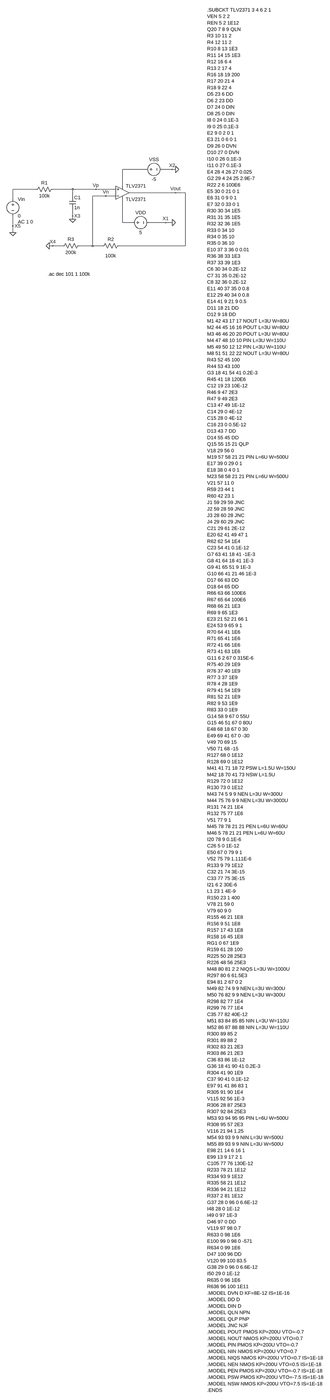
[diagram p0: schematic project5_p1.asc, whole sheet]
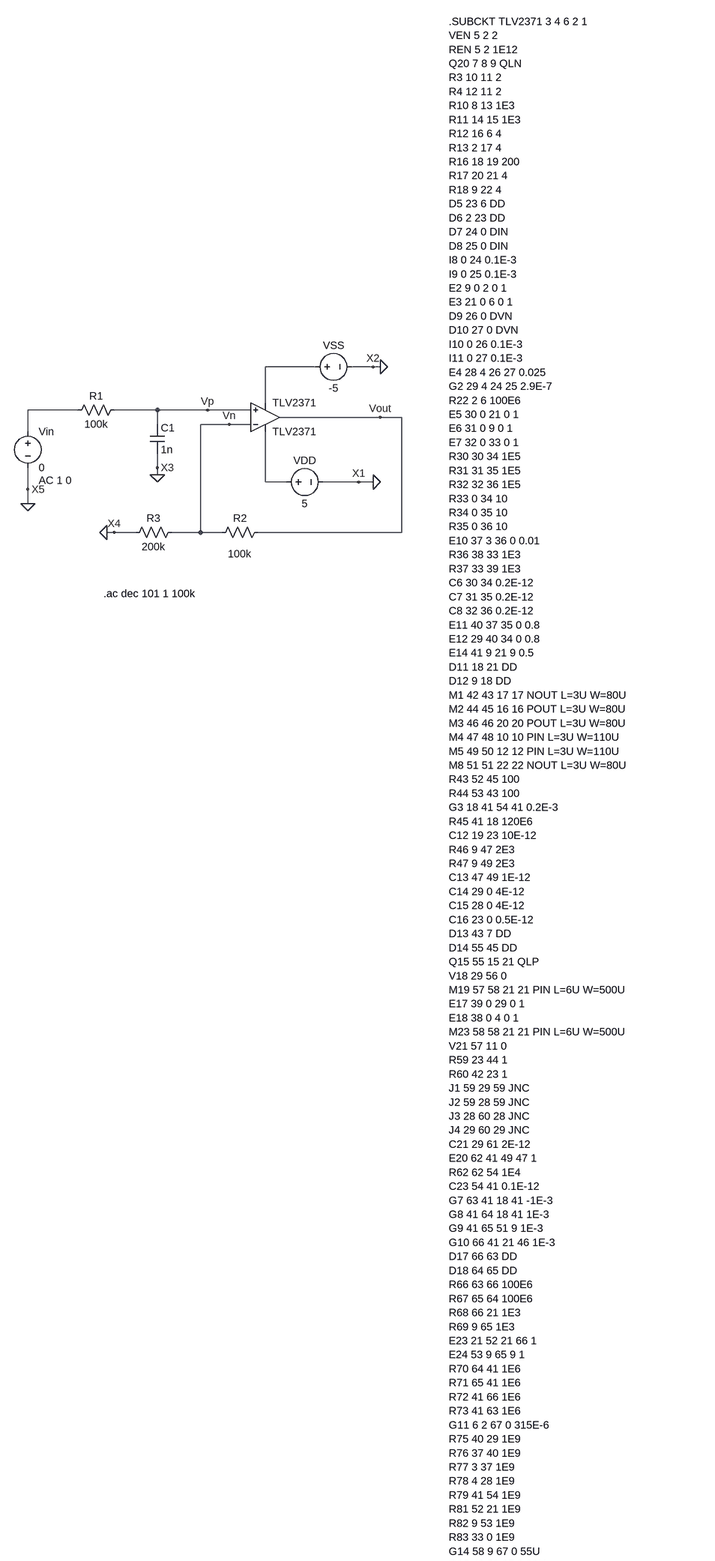
[diagram p1: schematic project5_p1.asc, part, row 1 of 2, column 1 of 1]
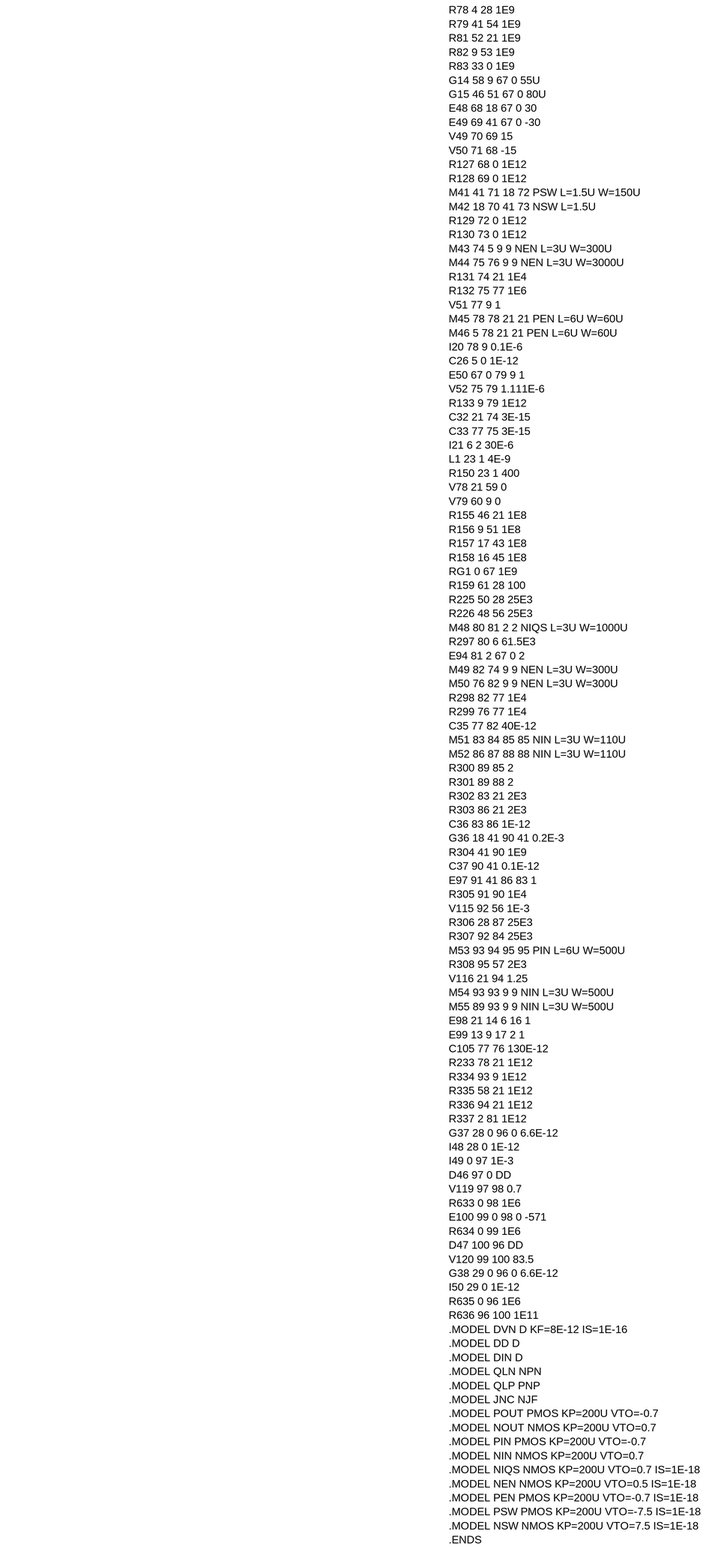
[diagram p2: schematic project5_p1.asc, part, row 2 of 2, column 1 of 1]
project5_p1.asc, the LTspice schematic file:
Version 4
SHEET 1 1680 5860
WIRE 288 -48 176 -48
WIRE 416 -48 368 -48
WIRE 432 -48 416 -48
WIRE 176 32 176 -48
WIRE -240 48 -352 48
WIRE -64 48 -160 48
WIRE 48 48 -64 48
WIRE 144 48 48 48
WIRE 432 64 208 64
WIRE 480 64 432 64
WIRE -64 80 -64 48
WIRE 96 80 32 80
WIRE 144 80 96 80
WIRE -352 96 -352 48
WIRE -64 176 -64 144
WIRE -64 192 -64 176
WIRE 176 208 176 96
WIRE 224 208 176 208
WIRE 384 208 304 208
WIRE 416 208 384 208
WIRE -352 224 -352 176
WIRE -352 256 -352 224
WIRE -160 320 -176 320
WIRE -112 320 -160 320
WIRE 32 320 32 80
WIRE 32 320 -32 320
WIRE 80 320 32 320
WIRE 480 320 480 64
WIRE 480 320 160 320
FLAG -176 320 0
FLAG 416 208 0
FLAG 432 -48 0
FLAG -352 256 0
FLAG -352 224 X5
FLAG 416 -48 X2
FLAG 384 208 X1
FLAG -160 320 X4
FLAG 432 64 Vout
FLAG -64 192 0
FLAG -64 176 X3
FLAG 48 48 Vp
FLAG 96 80 Vn
SYMBOL res -144 32 R90
WINDOW 0 0 56 VBottom 2
WINDOW 3 32 56 VTop 2
SYMATTR InstName R1
SYMATTR Value 100k
SYMBOL res 176 304 R90
WINDOW 0 0 56 VBottom 2
WINDOW 3 48 57 VTop 2
SYMATTR InstName R2
SYMATTR Value 100k
SYMBOL res -128 336 R270
WINDOW 0 32 56 VTop 2
WINDOW 3 0 56 VBottom 2
SYMATTR InstName R3
SYMATTR Value 200k
SYMBOL voltage 208 208 R270
WINDOW 0 32 56 VTop 2
WINDOW 3 -32 56 VBottom 2
WINDOW 123 0 0 Left 0
WINDOW 39 0 0 Left 0
SYMATTR InstName VDD
SYMATTR Value 5
SYMBOL voltage 272 -48 R270
WINDOW 0 32 56 VTop 2
WINDOW 3 -32 56 VBottom 2
WINDOW 123 0 0 Left 0
WINDOW 39 0 0 Left 0
SYMATTR InstName VSS
SYMATTR Value -5
SYMBOL OpAmps\\opamp2 176 128 M180
SYMATTR InstName TLV2371
SYMATTR Value TLV2371
SYMBOL voltage -352 80 R0
WINDOW 123 24 124 Left 2
WINDOW 39 0 0 Left 0
SYMATTR Value2 AC 1 0
SYMATTR InstName Vin
SYMATTR Value 0
SYMBOL cap -80 80 R0
SYMATTR InstName C1
SYMATTR Value 1n
TEXT 1096 -816 Left 2 !.SUBCKT TLV2371 3 4 6 2 1\nVEN 5 2 2\nREN 5 2 1E12\nQ20 7 8 9 QLN\nR3 10 11 2\nR4 12 11 2\nR10 8 13 1E3\nR11 14 15 1E3\nR12 16 6 4\nR13 2 17 4\nR16 18 19 200\nR17 20 21 4\nR18 9 22 4\nD5 23 6 DD\nD6 2 23 DD\nD7 24 0 DIN\nD8 25 0 DIN\nI8 0 24 0.1E-3\nI9 0 25 0.1E-3\nE2 9 0 2 0 1\nE3 21 0 6 0 1\nD9 26 0 DVN\nD10 27 0 DVN\nI10 0 26 0.1E-3\nI11 0 27 0.1E-3\nE4 28 4 26 27 0.025\nG2 29 4 24 25 2.9E-7\nR22 2 6 100E6\nE5 30 0 21 0 1\nE6 31 0 9 0 1\nE7 32 0 33 0 1\nR30 30 34 1E5\nR31 31 35 1E5\nR32 32 36 1E5\nR33 0 34 10\nR34 0 35 10\nR35 0 36 10\nE10 37 3 36 0 0.01\nR36 38 33 1E3\nR37 33 39 1E3\nC6 30 34 0.2E-12\nC7 31 35 0.2E-12\nC8 32 36 0.2E-12\nE11 40 37 35 0 0.8\nE12 29 40 34 0 0.8\nE14 41 9 21 9 0.5\nD11 18 21 DD\nD12 9 18 DD\nM1 42 43 17 17 NOUT L=3U W=80U\nM2 44 45 16 16 POUT L=3U W=80U\nM3 46 46 20 20 POUT L=3U W=80U\nM4 47 48 10 10 PIN L=3U W=110U\nM5 49 50 12 12 PIN L=3U W=110U\nM8 51 51 22 22 NOUT L=3U W=80U\nR43 52 45 100\nR44 53 43 100\nG3 18 41 54 41 0.2E-3\nR45 41 18 120E6\nC12 19 23 10E-12\nR46 9 47 2E3\nR47 9 49 2E3\nC13 47 49 1E-12\nC14 29 0 4E-12\nC15 28 0 4E-12\nC16 23 0 0.5E-12\nD13 43 7 DD\nD14 55 45 DD\nQ15 55 15 21 QLP\nV18 29 56 0\nM19 57 58 21 21 PIN L=6U W=500U\nE17 39 0 29 0 1\nE18 38 0 4 0 1\nM23 58 58 21 21 PIN L=6U W=500U\nV21 57 11 0\nR59 23 44 1\nR60 42 23 1\nJ1 59 29 59 JNC\nJ2 59 28 59 JNC\nJ3 28 60 28 JNC\nJ4 29 60 29 JNC\nC21 29 61 2E-12\nE20 62 41 49 47 1\nR62 62 54 1E4\nC23 54 41 0.1E-12\nG7 63 41 18 41 -1E-3\nG8 41 64 18 41 1E-3\nG9 41 65 51 9 1E-3\nG10 66 41 21 46 1E-3\nD17 66 63 DD\nD18 64 65 DD\nR66 63 66 100E6\nR67 65 64 100E6\nR68 66 21 1E3\nR69 9 65 1E3\nE23 21 52 21 66 1\nE24 53 9 65 9 1\nR70 64 41 1E6\nR71 65 41 1E6\nR72 41 66 1E6\nR73 41 63 1E6\nG11 6 2 67 0 315E-6\nR75 40 29 1E9\nR76 37 40 1E9\nR77 3 37 1E9\nR78 4 28 1E9\nR79 41 54 1E9\nR81 52 21 1E9\nR82 9 53 1E9\nR83 33 0 1E9\nG14 58 9 67 0 55U\nG15 46 51 67 0 80U\nE48 68 18 67 0 30\nE49 69 41 67 0 -30\nV49 70 69 15\nV50 71 68 -15\nR127 68 0 1E12\nR128 69 0 1E12\nM41 41 71 18 72 PSW L=1.5U W=150U\nM42 18 70 41 73 NSW L=1.5U\nR129 72 0 1E12\nR130 73 0 1E12\nM43 74 5 9 9 NEN L=3U W=300U\nM44 75 76 9 9 NEN L=3U W=3000U\nR131 74 21 1E4\nR132 75 77 1E6\nV51 77 9 1\nM45 78 78 21 21 PEN L=6U W=60U\nM46 5 78 21 21 PEN L=6U W=60U\nI20 78 9 0.1E-6\nC26 5 0 1E-12\nE50 67 0 79 9 1\nV52 75 79 1.111E-6\nR133 9 79 1E12\nC32 21 74 3E-15\nC33 77 75 3E-15\nI21 6 2 30E-6\nL1 23 1 4E-9\nR150 23 1 400\nV78 21 59 0\nV79 60 9 0\nR155 46 21 1E8\nR156 9 51 1E8\nR157 17 43 1E8\nR158 16 45 1E8\nRG1 0 67 1E9\nR159 61 28 100\nR225 50 28 25E3\nR226 48 56 25E3\nM48 80 81 2 2 NIQS L=3U W=1000U\nR297 80 6 61.5E3\nE94 81 2 67 0 2\nM49 82 74 9 9 NEN L=3U W=300U\nM50 76 82 9 9 NEN L=3U W=300U\nR298 82 77 1E4\nR299 76 77 1E4\nC35 77 82 40E-12\nM51 83 84 85 85 NIN L=3U W=110U\nM52 86 87 88 88 NIN L=3U W=110U\nR300 89 85 2\nR301 89 88 2\nR302 83 21 2E3\nR303 86 21 2E3\nC36 83 86 1E-12\nG36 18 41 90 41 0.2E-3\nR304 41 90 1E9\nC37 90 41 0.1E-12\nE97 91 41 86 83 1\nR305 91 90 1E4\nV115 92 56 1E-3\nR306 28 87 25E3\nR307 92 84 25E3\nM53 93 94 95 95 PIN L=6U W=500U\nR308 95 57 2E3\nV116 21 94 1.25\nM54 93 93 9 9 NIN L=3U W=500U\nM55 89 93 9 9 NIN L=3U W=500U\nE98 21 14 6 16 1\nE99 13 9 17 2 1\nC105 77 76 130E-12\nR233 78 21 1E12\nR334 93 9 1E12\nR335 58 21 1E12\nR336 94 21 1E12\nR337 2 81 1E12\nG37 28 0 96 0 6.6E-12\nI48 28 0 1E-12\nI49 0 97 1E-3\nD46 97 0 DD\nV119 97 98 0.7\nR633 0 98 1E6\nE100 99 0 98 0 -571\nR634 0 99 1E6\nD47 100 96 DD\nV120 99 100 83.5\nG38 29 0 96 0 6.6E-12\nI50 29 0 1E-12\nR635 0 96 1E6\nR636 96 100 1E11\n.MODEL DVN D KF=8E-12 IS=1E-16\n.MODEL DD D\n.MODEL DIN D\n.MODEL QLN NPN\n.MODEL QLP PNP\n.MODEL JNC NJF\n.MODEL POUT PMOS KP=200U VTO=-0.7\n.MODEL NOUT NMOS KP=200U VTO=0.7\n.MODEL PIN PMOS KP=200U VTO=-0.7\n.MODEL NIN NMOS KP=200U VTO=0.7\n.MODEL NIQS NMOS KP=200U VTO=0.7 IS=1E-18\n.MODEL NEN NMOS KP=200U VTO=0.5 IS=1E-18\n.MODEL PEN PMOS KP=200U VTO=-0.7 IS=1E-18\n.MODEL PSW PMOS KP=200U VTO=-7.5 IS=1E-18\n.MODEL NSW NMOS KP=200U VTO=7.5 IS=1E-18\n.ENDS
TEXT -184 456 Left 2 !.ac dec 101 1 100k

The netlist it stands for:
* project5_p1.asc
R1 Vp N002 100k
R2 Vout Vn 100k
R3 0 Vn 200k
VDD N003 0 5
VSS N001 0 -5
XTLV2371 Vp Vn N003 N001 Vout TLV2371  ; pins In+ In- V+ V- OUT
Vin N002 0 0 AC 1 0
C1 Vp 0 1n
.SUBCKT TLV2371 3 4 6 2 1
VEN 5 2 2
REN 5 2 1E12
Q20 7 8 9 QLN
R3 10 11 2
R4 12 11 2
R10 8 13 1E3
R11 14 15 1E3
R12 16 6 4
R13 2 17 4
R16 18 19 200
R17 20 21 4
R18 9 22 4
D5 23 6 DD
D6 2 23 DD
D7 24 0 DIN
D8 25 0 DIN
I8 0 24 0.1E-3
I9 0 25 0.1E-3
E2 9 0 2 0 1
E3 21 0 6 0 1
D9 26 0 DVN
D10 27 0 DVN
I10 0 26 0.1E-3
I11 0 27 0.1E-3
E4 28 4 26 27 0.025
G2 29 4 24 25 2.9E-7
R22 2 6 100E6
E5 30 0 21 0 1
E6 31 0 9 0 1
E7 32 0 33 0 1
R30 30 34 1E5
R31 31 35 1E5
R32 32 36 1E5
R33 0 34 10
R34 0 35 10
R35 0 36 10
E10 37 3 36 0 0.01
R36 38 33 1E3
R37 33 39 1E3
C6 30 34 0.2E-12
C7 31 35 0.2E-12
C8 32 36 0.2E-12
E11 40 37 35 0 0.8
E12 29 40 34 0 0.8
E14 41 9 21 9 0.5
D11 18 21 DD
D12 9 18 DD
M1 42 43 17 17 NOUT L=3U W=80U
M2 44 45 16 16 POUT L=3U W=80U
M3 46 46 20 20 POUT L=3U W=80U
M4 47 48 10 10 PIN L=3U W=110U
M5 49 50 12 12 PIN L=3U W=110U
M8 51 51 22 22 NOUT L=3U W=80U
R43 52 45 100
R44 53 43 100
G3 18 41 54 41 0.2E-3
R45 41 18 120E6
C12 19 23 10E-12
R46 9 47 2E3
R47 9 49 2E3
C13 47 49 1E-12
C14 29 0 4E-12
C15 28 0 4E-12
C16 23 0 0.5E-12
D13 43 7 DD
D14 55 45 DD
Q15 55 15 21 QLP
V18 29 56 0
M19 57 58 21 21 PIN L=6U W=500U
E17 39 0 29 0 1
E18 38 0 4 0 1
M23 58 58 21 21 PIN L=6U W=500U
V21 57 11 0
R59 23 44 1
R60 42 23 1
J1 59 29 59 JNC
J2 59 28 59 JNC
J3 28 60 28 JNC
J4 29 60 29 JNC
C21 29 61 2E-12
E20 62 41 49 47 1
R62 62 54 1E4
C23 54 41 0.1E-12
G7 63 41 18 41 -1E-3
G8 41 64 18 41 1E-3
G9 41 65 51 9 1E-3
G10 66 41 21 46 1E-3
D17 66 63 DD
D18 64 65 DD
R66 63 66 100E6
R67 65 64 100E6
R68 66 21 1E3
R69 9 65 1E3
E23 21 52 21 66 1
E24 53 9 65 9 1
R70 64 41 1E6
R71 65 41 1E6
R72 41 66 1E6
R73 41 63 1E6
G11 6 2 67 0 315E-6
R75 40 29 1E9
R76 37 40 1E9
R77 3 37 1E9
R78 4 28 1E9
R79 41 54 1E9
R81 52 21 1E9
R82 9 53 1E9
R83 33 0 1E9
G14 58 9 67 0 55U
G15 46 51 67 0 80U
E48 68 18 67 0 30
E49 69 41 67 0 -30
V49 70 69 15
V50 71 68 -15
R127 68 0 1E12
R128 69 0 1E12
M41 41 71 18 72 PSW L=1.5U W=150U
M42 18 70 41 73 NSW L=1.5U
R129 72 0 1E12
R130 73 0 1E12
M43 74 5 9 9 NEN L=3U W=300U
M44 75 76 9 9 NEN L=3U W=3000U
R131 74 21 1E4
R132 75 77 1E6
V51 77 9 1
M45 78 78 21 21 PEN L=6U W=60U
M46 5 78 21 21 PEN L=6U W=60U
I20 78 9 0.1E-6
C26 5 0 1E-12
E50 67 0 79 9 1
V52 75 79 1.111E-6
R133 9 79 1E12
C32 21 74 3E-15
C33 77 75 3E-15
I21 6 2 30E-6
L1 23 1 4E-9
R150 23 1 400
V78 21 59 0
V79 60 9 0
R155 46 21 1E8
R156 9 51 1E8
R157 17 43 1E8
R158 16 45 1E8
RG1 0 67 1E9
R159 61 28 100
R225 50 28 25E3
R226 48 56 25E3
M48 80 81 2 2 NIQS L=3U W=1000U
R297 80 6 61.5E3
E94 81 2 67 0 2
M49 82 74 9 9 NEN L=3U W=300U
M50 76 82 9 9 NEN L=3U W=300U
R298 82 77 1E4
R299 76 77 1E4
C35 77 82 40E-12
M51 83 84 85 85 NIN L=3U W=110U
M52 86 87 88 88 NIN L=3U W=110U
R300 89 85 2
R301 89 88 2
R302 83 21 2E3
R303 86 21 2E3
C36 83 86 1E-12
G36 18 41 90 41 0.2E-3
R304 41 90 1E9
C37 90 41 0.1E-12
E97 91 41 86 83 1
R305 91 90 1E4
V115 92 56 1E-3
R306 28 87 25E3
R307 92 84 25E3
M53 93 94 95 95 PIN L=6U W=500U
R308 95 57 2E3
V116 21 94 1.25
M54 93 93 9 9 NIN L=3U W=500U
M55 89 93 9 9 NIN L=3U W=500U
E98 21 14 6 16 1
E99 13 9 17 2 1
C105 77 76 130E-12
R233 78 21 1E12
R334 93 9 1E12
R335 58 21 1E12
R336 94 21 1E12
R337 2 81 1E12
G37 28 0 96 0 6.6E-12
I48 28 0 1E-12
I49 0 97 1E-3
D46 97 0 DD
V119 97 98 0.7
R633 0 98 1E6
E100 99 0 98 0 -571
R634 0 99 1E6
D47 100 96 DD
V120 99 100 83.5
G38 29 0 96 0 6.6E-12
I50 29 0 1E-12
R635 0 96 1E6
R636 96 100 1E11
.MODEL DVN D KF=8E-12 IS=1E-16
.MODEL DD D
.MODEL DIN D
.MODEL QLN NPN
.MODEL QLP PNP
.MODEL JNC NJF
.MODEL POUT PMOS KP=200U VTO=-0.7
.MODEL NOUT NMOS KP=200U VTO=0.7
.MODEL PIN PMOS KP=200U VTO=-0.7
.MODEL NIN NMOS KP=200U VTO=0.7
.MODEL NIQS NMOS KP=200U VTO=0.7 IS=1E-18
.MODEL NEN NMOS KP=200U VTO=0.5 IS=1E-18
.MODEL PEN PMOS KP=200U VTO=-0.7 IS=1E-18
.MODEL PSW PMOS KP=200U VTO=-7.5 IS=1E-18
.MODEL NSW NMOS KP=200U VTO=7.5 IS=1E-18
.ENDS
.ac dec 101 1 100k
.backanno
.end